# EAGLE design shield (EAGLE 8.3.2)
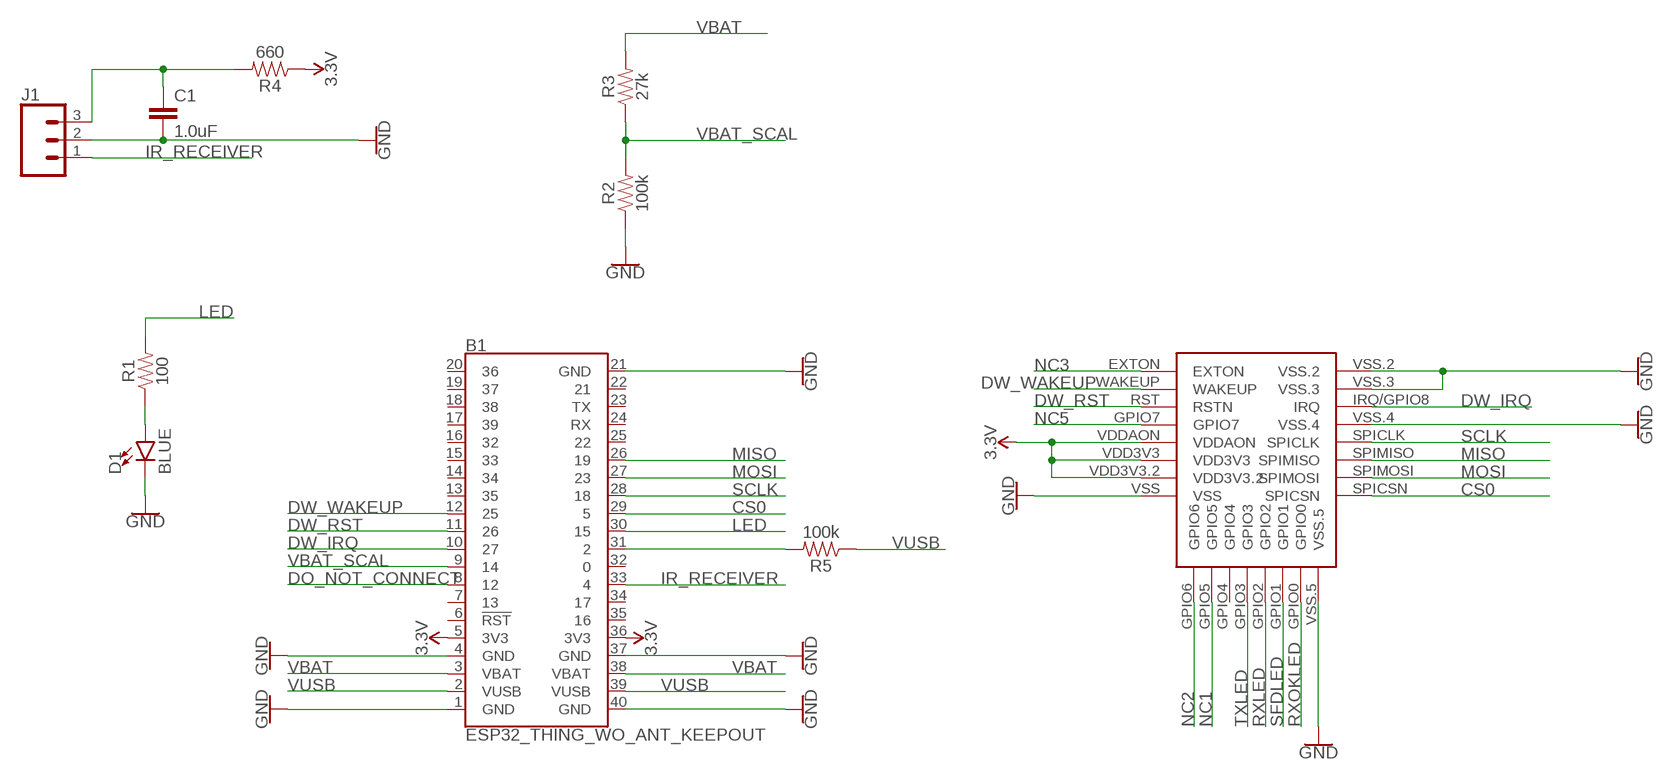
[diagram p0: schematic, sheet 1]

## Parts
B1  ESP32_THING_WO_ANT_KEEPOUT  [ESP32_THING_NO_ANT]
C1  1.0uF  1.0UF-1206-50V-10%  [1206]
D1  BLUE  LED-BLUE1206  [LED-1206]
J1  CONN_03  [1X03]
R1  100  RESISTOR1206  [1206]
R2  100k  RESISTOR1206  [1206]
R3  27k  RESISTOR1206  [1206]
R4  660  RESISTOR1206  [1206]
R5  100k  RESISTOR1206  [1206]
U$1  DWM1000  [DWM1000]

## Nets
3.3V: B1.5(3V3) B1.36(3V3) R4.1 U$1.VDD3V3 U$1.VDD3V3.2 U$1.VDDAON
CS0: B1.29 U$1.SPICSN
DO_NOT_CONNECT: B1.8
DW_IRQ: B1.10 U$1.IRQ/GPIO8(IRQ)
DW_RST: B1.11 U$1.RST(RSTN)
DW_WAKEUP: B1.12 U$1.WAKEUP
GND: B1.1(GND) B1.4(GND) B1.21(GND) B1.37(GND) B1.40(GND) C1.2 D1.C J1.2 R2.1 U$1.VSS U$1.VSS.2 U$1.VSS.3 U$1.VSS.4 U$1.VSS.5
IR_RECEIVER: B1.33 J1.1
LED: B1.30 R1.2
MISO: B1.26 U$1.SPIMISO
MOSI: B1.27 U$1.SPIMOSI
N$1: C1.1 J1.3 R4.2
N$4: D1.A R1.1
N$7: B1.31 R5.2
NC1: U$1.GPIO5
NC2: U$1.GPIO6
NC3: U$1.EXTON
NC5: U$1.GPIO7
RXLED: U$1.GPIO2
RXOKLED: U$1.GPIO0
SCLK: B1.28 U$1.SPICLK
SFDLED: U$1.GPIO1
TXLED: U$1.GPIO3
VBAT: B1.3(VBAT) B1.38(VBAT) R3.2
VBAT_SCAL: B1.9 R2.2 R3.1
VUSB: B1.2(VUSB) B1.39(VUSB) R5.1
Unconnected: B1.6(!RST!) B1.7 B1.13 B1.14 B1.15 B1.16 B1.17 B1.18 B1.19 B1.20 B1.22 B1.23(TX) B1.24(RX) B1.25 B1.32 B1.34 B1.35 U$1.GPIO4

## Library data of the parts
B1 = SparkFun-Boards:ESP32_THING: SparkFun ESP32 Thing Board Pins, silkscreen, and logos matching the layout of the SparkFun ESP32 Thing <https://www.sparkfun.com/products/13907> Dimensions: 2.32" x 1.00"
C1 = SparkFun-Capacitors:1.0UF: 1µF ceramic capacitors A capacitor is a passive two-terminal electrical component used to store electrical energy temporarily in an electric field.; PROD_ID: CAP-09822
D1 = SparkFun-LED:LED-BLUE: Blue SMD LED Used in manufacturing of various products at SparkFun Packages: 0603 - SMD 0603 package [Product Link] <http://www.digikey.com/product-detail/en/SMLE12BC7TT86/511-1589-2-ND/1641808> 1206 - SMD1206 package [Product Link] <http://www.digikey.com/product-detail/en/lite-on-inc/LTST-C150TBKT/160-1643-1-ND/573584> SparkFun Products: ESP8266 Thing-Dev Board <https://www.sparkfun.com/products/13711> RedBoard <https://www.sparkfun.com/products/12757>; PROD_ID: DIO-09911
J1 = SparkFun-Connectors:CONN_03: Multi connection point. Often used as Generic Header-pin footprint for 0.1 inch spaced/style header connections On any of the 0.1 inch spaced packages, you can populate with these: Break Away Headers - Straight <https://www.sparkfun.com/products/116> (PRT-00116) Break Away Male Headers - Right Angle <https://www.sparkfun.com/products/553> (PRT-00553) Female Headers <https://www.sparkfun.com/products/115> (PRT-00115) Break Away Headers - Machine Pin <https://www.sparkfun.com/products/117> (PRT-00117) Break Away Female Headers - Swiss Machine Pin <https://www.sparkfun.com/products/743> (PRT-00743) Stackable Header - 3 Pin (Female, 0.1") <https://www.sparkfun.com/products/13875> (PRT-13875) For SCREWTERMINALS and SPRING TERMINALS visit here: Screw Terimnals on SparkFun.com <https://www.sparkfun.com/search/results?term=Screw+Terminals> (5mm/3.5mm/2.54mm spacing) This device is also useful as a general connection point to wire up your design to another part of your project. Our various solder wires solder well into these plated through hole pads. Hook-Up Wire - Assortment (Stranded, 22 AWG) <https://www.sparkfun.com/products/11375> (PRT-11375) Hook-Up Wire - Assortment (Solid Core, 22 AWG) <https://www.sparkfun.com/products/11367> (PRT-11367) View the entire wire category on our website here <https://www.sparkfun.com/categories/141> Special notes: Molex polarized connector foot print use with SKU : PRT-08232 with associated crimp pins and housings.
R1-R5 = SparkFun-Resistors:RESISTOR: Generic Resistor Package
U$1 = DWM1000:DWM1000

## Board
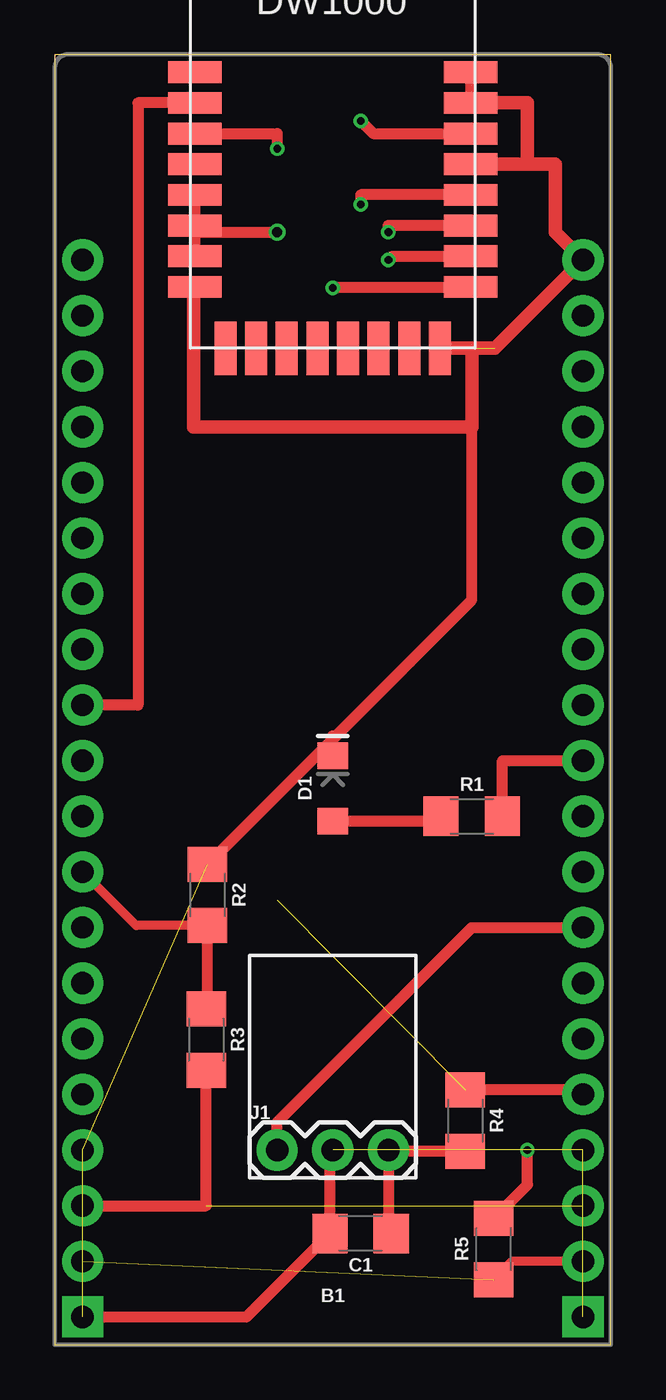
[diagram p1: board, top side]
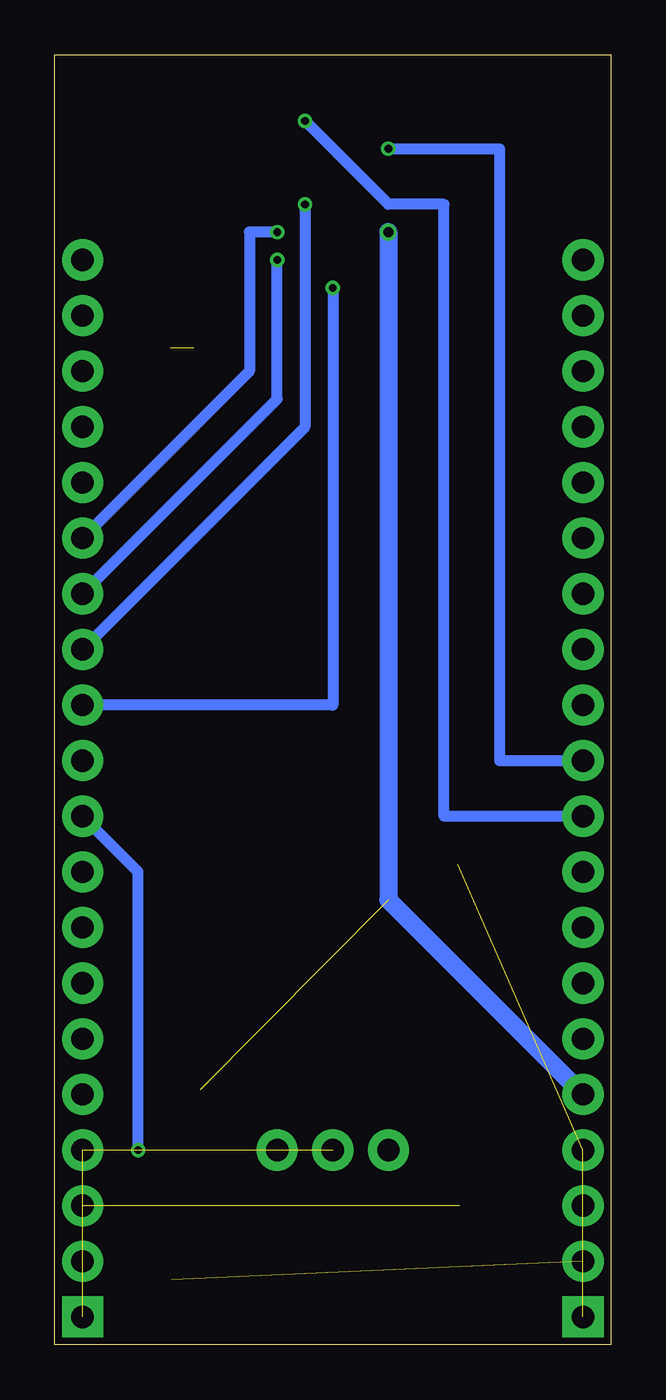
[diagram p2: board, bottom side, seen from below]

Size 25.4 x 58.9 mm. Coordinates in mm from the lower left corner, seen from the top.
Outline: 0,0 25.4,0 25.4,58.9 0,58.9 0,0
Copper layers (1*16): Top 0.035mm / dielectric 1.5mm / Bottom 0.035mm
Design rules "SeeedStudio_2layer_DRU_no_angle_20140221 *": minimum track width 6mil, minimum drill 12mil, track to track 7mil, track to pad 6mil, pad to pad 6mil, via to via 6mil, smd to smd 0mil, copper to edge 10mil, drill to drill 10mil, minimum pad ring 10mil, minimum via ring 6mil, stop-mask expansion 2mil, vias tented up to drill 100mil, thermal gap 10mil

### Footprints (pad centres in the part's own frame; a part is rotated, then mirrored left to right if it is on the bottom)
ESP32_THING_NO_ANT = drill 1.016 pad 1.88 square: 1 1.27,1.27; 40 24.13,1.27 | drill 1.016 pad 1.88: 2 1.27,3.81; 3 1.27,6.35; 4 1.27,8.89; 5 1.27,11.43; 6 1.27,13.97; 7 1.27,16.51; 8 1.27,19.05; 9 1.27,21.59; 10 1.27,24.13; 11 1.27,26.67; 12 1.27,29.21; 13 1.27,31.75; 14 1.27,34.29; 15 1.27,36.83; 16 1.27,39.37; 17 1.27,41.91; 18 1.27,44.45; 19 1.27,46.99; 20 1.27,49.53; 21 24.13,49.53; 22 24.13,46.99; 23 24.13,44.45; 24 24.13,41.91; 25 24.13,39.37; 26 24.13,36.83; 27 24.13,34.29; 28 24.13,31.75; 29 24.13,29.21; 30 24.13,26.67; 31 24.13,24.13; 32 24.13,21.59; 33 24.13,19.05; 34 24.13,16.51; 35 24.13,13.97; 36 24.13,11.43; 37 24.13,8.89; 38 24.13,6.35; 39 24.13,3.81
1206 = smd 1.6 x 1.8: 1 -1.4,0; 2 1.4,0
LED-1206 = smd 1.2 x 1.4: A -1.5,0; C 1.5,0
1X03 = drill 1.016 pad 1.88: 1 0,0; 2 2.54,0; 3 5.08,0
DWM1000 = smd 2.45 x 1: EXTON -2.8,12.6; GPIO7 -2.8,8.4; IRQ/GPIO8 9.8,9.8; RST -2.8,9.8; SPICLK 9.8,7; SPICSN 9.8,2.8; SPIMISO 9.8,5.6; SPIMOSI 9.8,4.2; VDD3V3 -2.8,4.2; VDD3V3.2 -2.8,5.6; VDDAON -2.8,7; VSS -2.8,2.8; VSS.2 9.8,12.6; VSS.3 9.8,11.2; VSS.4 9.8,8.4; WAKEUP -2.8,11.2 | smd 1 x 2.45: GPIO0 7,0; GPIO1 5.6,0; GPIO2 4.2,0; GPIO3 2.8,0; GPIO4 1.4,0; GPIO5 0,0; GPIO6 -1.4,0; VSS.5 8.4,0

### Placement (x,y rotation side)
B1  0,0 0 top
C1  13.97,5.08 180 top
D1  12.7,25.4 90 top
J1  10.16,8.89 0 top
R1  19.05,24.13 0 top
R2  6.98,20.54 270 top
R3  6.92,13.93 270 top
R4  18.75,10.23 270 top
R5  20.05,4.37 90 top
U$1  9.2,45.5 0 top

### Tracks (layer width: path | path; a pad name or v marks a point on that pad's centre or on a via)
3.3V  (via drill 0.45)  (1 unrouted)
  Top 0.508: R4.1 23.93,11.63 B1.36 | U$1.VDDAON U$1.VDD3V3.2 U$1.VDD3V3 6.39,50.8 v10.16,50.8
  Bottom 0.813: v10.16,50.8 10.16,20.32 B1.5
CS0  (via drill 0.35)
  Top 0.508: U$1.SPICSN 19,48.26 v12.7,48.26
  Bottom 0.508: v12.7,48.26 12.7,29.21 B1.29
DW_IRQ  (via drill 0.35)
  Top 0.508: v13.97,55.88 14.55,55.3 U$1.IRQ/GPIO8
  Bottom 0.508: B1.10 7.62,24.13 7.62,52.07 10.16,52.07 v13.97,55.88
DW_RST  (via drill 0.35)
  Top 0.508: U$1.RST 10.16,55.3 v10.16,54.61
  Bottom 0.508: v10.16,54.61 5.08,54.61 5.08,26.67 B1.11
DW_WAKEUP
  Top 0.508: U$1.WAKEUP 3.81,56.7 3.81,29.21 B1.12
GND  (5 unrouted)
  Top 0.508: J1.2 12.57,8.76 C1.2 8.76,1.27 B1.1 | U$1.VSS.2 U$1.VSS.3 | 6.35,48.3 U$1.VSS | 12.84,27.8 R2.1 | 12.84,27.8 19.05,34.01 19.05,41.91 | D1.C 12.7,27.8 12.84,27.8
  Top 0.61: 21.59,53.9 22.86,53.9 22.86,50.8 B1.21 20.1,45.5 U$1.VSS.5 | 21.59,53.9 U$1.VSS.4 | U$1.VSS.3 21.59,56.7 21.59,53.9 | 19.05,45.5 19.05,41.91 6.35,41.91 6.35,48.3
IR_RECEIVER
  Top 0.508: J1.1 10.16,10.16 19.05,19.05 B1.33
LED
  Top 0.508: R1.2 20.45,26.67 B1.30
MISO  (via drill 0.35)
  Top 0.508: U$1.SPIMISO 15.24,51.1 v15.24,50.8
  Bottom 0.508: v15.24,50.8 16.51,50.8 16.51,44.45 B1.26
MOSI  (via drill 0.35)
  Top 0.508: v15.24,49.53 15.41,49.7 U$1.SPIMOSI
  Bottom 0.508: B1.27 15.24,43.18 v15.24,49.53
N$1
  Top 0.508: C1.1 15.24,5.21 J1.3 15.3,8.83 R4.2
N$4
  Top 0.508: R1.1 17.65,23.9 D1.A
N$7  (via drill 0.35)
  Top 0.508: R5.2 21.59,7.31 v21.59,8.89
  Bottom 0.508: v21.59,8.89 21.59,21.59 B1.31
SCLK  (via drill 0.35)
  Top 0.508: U$1.SPICLK 13.97,52.5 v13.97,52.07
  Bottom 0.508: v13.97,52.07 13.97,41.91 B1.28
VBAT  (1 unrouted)
  Top 0.508: B1.3 6.92,6.35 R3.2
VBAT_SCAL
  Top 0.406: R2.2 3.72,19.14 B1.9
  Top 0.508: R3.1 6.98,15.33 R2.2
VUSB  (1 unrouted)
  Top 0.406: B1.39 20.89,3.81 R5.1